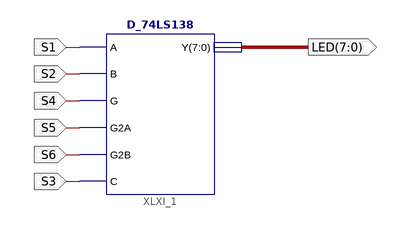
[diagram p0: schematic sheet 1]
// Xilinx ISE schematic D_74LS138_Test.sch (kintex7) as structural Verilog: 1 symbols, 7 ports
module D_74LS138_Test (
  input  S2,
  input  S4,
  input  S5,
  input  S6,
  input  S3,
  input  S1,
  output [7:0] LED
);

  D_74LS138 XLXI_1 (.A(S1), .B(S2), .G(S4), .G2A(S5), .G2B(S6), .C(S3), .Y(LED));
endmodule
